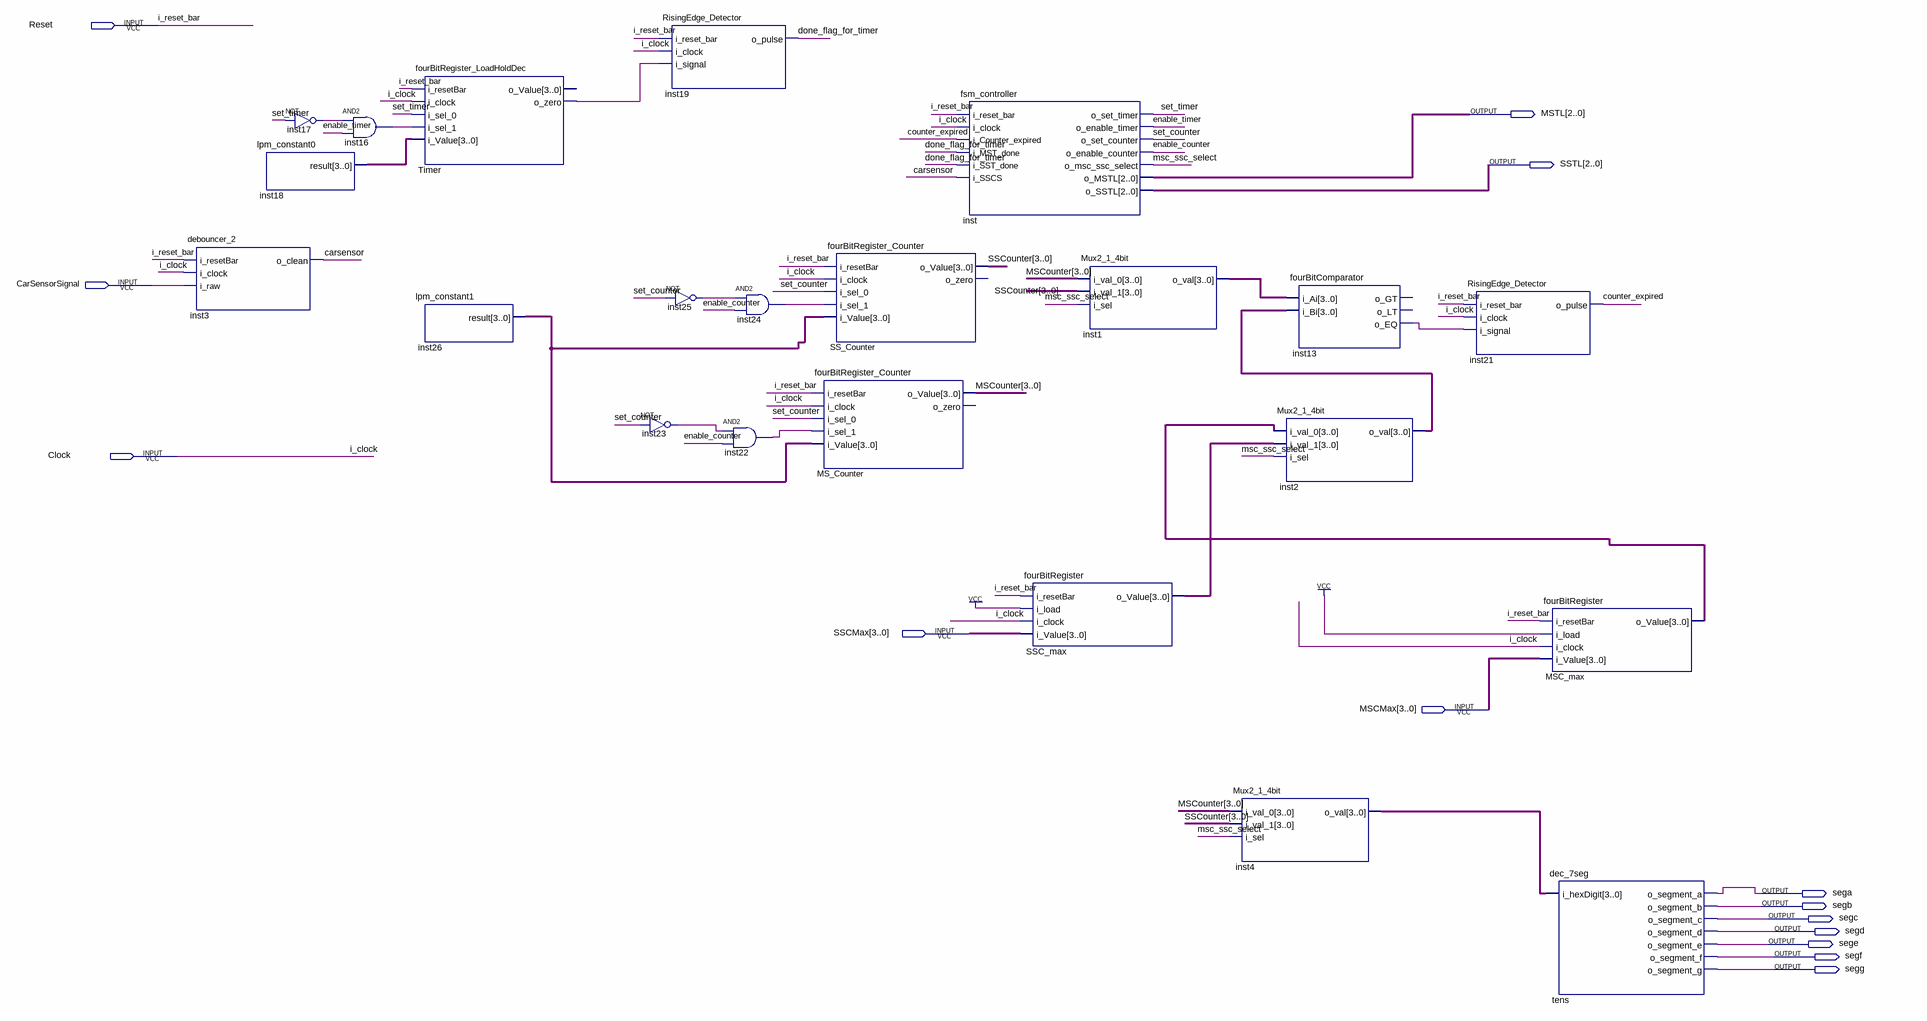
[diagram p0: schematic sheet]
// Quartus schematic trafficLightController.bdf as structural Verilog: 22 symbols, 14 pins
module trafficLightController (
  input  Reset,
  input  CarSensorSignal,
  input  Clock,
  input  [3:0] SSCMax,
  input  [3:0] MSCMax,
  output [2:0] MSTL,
  output [2:0] SSTL,
  output sega,
  output segb,
  output segc,
  output segd,
  output sege,
  output segf,
  output segg
);

  wire carsensor, counter_expired, done_flag_for_timer, enable_counter, enable_timer, inst13_o_eq,
       inst16_out, inst17_out, inst22_out, inst23_out, inst24_out, inst25_out, msc_ssc_select, set_counter,
       set_timer, Timer_o_zero;
  wire [3:0] inst1_o_val, inst2_o_val, inst4_o_val, inst18_result, inst26_result, MSC_max_o_value, MSCounter,
       SSC_max_o_value, SSCounter;

  debouncer_2 inst3 (.i_resetBar(Reset), .i_clock(Clock), .i_raw(CarSensorSignal), .o_clean(carsensor));
  lpm_constant0 inst18 (.result(inst18_result));
  not inst17 (inst17_out, set_timer);
  and inst16 (inst16_out, inst17_out, enable_timer);
  fourBitRegister_LoadHoldDec Timer (
    .i_resetBar(Reset), .i_clock(Clock), .i_sel_0(set_timer), .i_sel_1(inst16_out), .i_Value(inst18_result),
    .o_zero(Timer_o_zero));  // open: o_Value
  lpm_constant1 inst26 (.result(inst26_result));
  RisingEdge_Detector inst19 (
    .i_reset_bar(Reset), .i_clock(Clock), .i_signal(Timer_o_zero), .o_pulse(done_flag_for_timer));
  not inst25 (inst25_out, set_counter);
  not inst23 (inst23_out, set_counter);
  and inst24 (inst24_out, inst25_out, enable_counter);
  and inst22 (inst22_out, inst23_out, enable_counter);
  fourBitRegister_Counter SS_Counter (
    .i_resetBar(Reset), .i_clock(Clock), .i_sel_0(set_counter), .i_sel_1(inst24_out),
    .i_Value(inst26_result), .o_Value(SSCounter));  // open: o_zero
  fourBitRegister_Counter MS_Counter (
    .i_resetBar(Reset), .i_clock(Clock), .i_sel_0(set_counter), .i_sel_1(inst22_out),
    .i_Value(inst26_result), .o_Value(MSCounter));  // open: o_zero
  fsm_controller inst (
    .i_reset_bar(Reset), .i_clock(Clock), .i_Counter_expired(counter_expired),
    .i_MST_done(done_flag_for_timer), .i_SST_done(done_flag_for_timer), .i_SSCS(carsensor),
    .o_set_timer(set_timer), .o_enable_timer(enable_timer), .o_set_counter(set_counter),
    .o_enable_counter(enable_counter), .o_msc_ssc_select(msc_ssc_select), .o_MSTL(MSTL), .o_SSTL(SSTL));
  fourBitRegister SSC_max (
    .i_resetBar(Reset), .i_load(1'b1), .i_clock(Clock), .i_Value(SSCMax), .o_Value(SSC_max_o_value));
  Mux2_1_4bit inst1 (.i_val_0(MSCounter), .i_val_1(SSCounter), .i_sel(msc_ssc_select), .o_val(inst1_o_val));
  Mux2_1_4bit inst4 (.i_val_0(MSCounter), .i_val_1(SSCounter), .i_sel(msc_ssc_select), .o_val(inst4_o_val));
  fourBitComparator inst13 (.i_Ai(inst1_o_val), .i_Bi(inst2_o_val), .o_EQ(inst13_o_eq));  // open: o_GT, o_LT
  Mux2_1_4bit inst2 (.i_val_0(MSC_max_o_value), .i_val_1(SSC_max_o_value), .i_sel(msc_ssc_select), .o_val(inst2_o_val));
  RisingEdge_Detector inst21 (.i_reset_bar(Reset), .i_clock(Clock), .i_signal(inst13_o_eq), .o_pulse(counter_expired));
  fourBitRegister MSC_max (
    .i_resetBar(Reset), .i_load(1'b1), .i_clock(Clock), .i_Value(MSCMax), .o_Value(MSC_max_o_value));
  dec_7seg tens (
    .i_hexDigit(inst4_o_val), .o_segment_a(sega), .o_segment_b(segb), .o_segment_c(segc), .o_segment_d(segd),
    .o_segment_e(sege), .o_segment_f(segf), .o_segment_g(segg));

  // Other names for the same wires on the sheet: i_clock = Clock; i_reset_bar = Reset
endmodule
